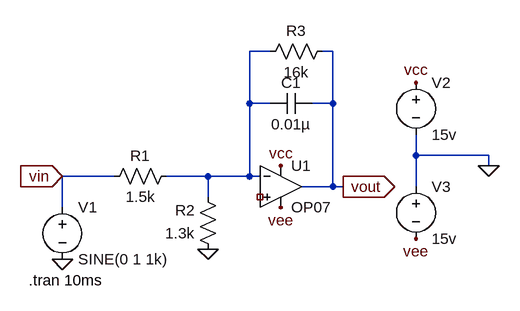
[diagram p0: schematic exp-4-int-electro.asc]
exp-4-int-electro.asc, the LTspice schematic file:
Version 4
SHEET 1 1044 680
WIRE 592 -64 560 -64
WIRE 688 -64 672 -64
WIRE 560 16 560 -64
WIRE 592 16 560 16
WIRE 688 16 688 -64
WIRE 688 16 656 16
WIRE 816 96 816 64
WIRE 928 96 816 96
WIRE 928 112 928 96
WIRE 352 128 272 128
WIRE 496 128 432 128
WIRE 560 128 560 16
WIRE 560 128 496 128
WIRE 576 128 560 128
WIRE 688 144 688 16
WIRE 688 144 640 144
WIRE 704 144 688 144
WIRE 816 144 816 96
WIRE 496 160 496 128
WIRE 272 176 272 128
FLAG 272 256 0
FLAG 496 240 0
FLAG 928 112 0
FLAG 816 -16 vcc
FLAG 608 112 vcc
FLAG 816 224 vee
FLAG 608 176 vee
FLAG 272 128 vin
IOPIN 272 128 In
FLAG 704 144 vout
IOPIN 704 144 Out
SYMBOL voltage 272 160 R0
WINDOW 123 0 0 Left 0
WINDOW 39 0 0 Left 0
SYMATTR InstName V1
SYMATTR Value SINE(0 1 1k)
SYMBOL res 448 112 R90
WINDOW 0 0 56 VBottom 2
WINDOW 3 32 56 VTop 2
SYMATTR InstName R1
SYMATTR Value 1.5k
SYMBOL res 512 256 R180
WINDOW 0 36 76 Left 2
WINDOW 3 36 40 Left 2
SYMATTR InstName R2
SYMATTR Value 1.3k
SYMBOL res 576 -48 R270
WINDOW 0 32 56 VTop 2
WINDOW 3 0 56 VBottom 2
SYMATTR InstName R3
SYMATTR Value 16k
SYMBOL cap 656 0 R90
WINDOW 0 0 32 VBottom 2
WINDOW 3 32 32 VTop 2
SYMATTR InstName C1
SYMATTR Value 0.01µ
SYMBOL Opamps\\OP07 608 80 R0
SYMATTR InstName U1
SYMBOL voltage 816 -32 R0
WINDOW 123 0 0 Left 0
WINDOW 39 0 0 Left 0
SYMATTR InstName V2
SYMATTR Value 15v
SYMBOL voltage 816 128 R0
WINDOW 123 0 0 Left 0
WINDOW 39 0 0 Left 0
SYMATTR InstName V3
SYMATTR Value 15v
TEXT 220 288 Left 2 !.tran 10ms

The netlist it stands for:
* exp-4-int-electro.asc
V1 vin 0 SINE(0 1 1k)
R1 N001 vin 1.5k
R2 0 N001 1.3k
R3 N001 vout 16k
C1 vout N001 0.01µ
XU1 NC_01 N001 vcc vee vout LT1001  ; OP07, pins In+ In- V+ V- OUT
V2 vcc 0 15v
V3 0 vee 15v
.tran 10ms
.lib LTC.lib
.backanno
.end